# EAGLE design buckler (EAGLE 9.1.1)
AUTHOR: Branden Ghena; REV: A; TITLE: Berkeley Buckler

## Sheet 1 of 3: Headers
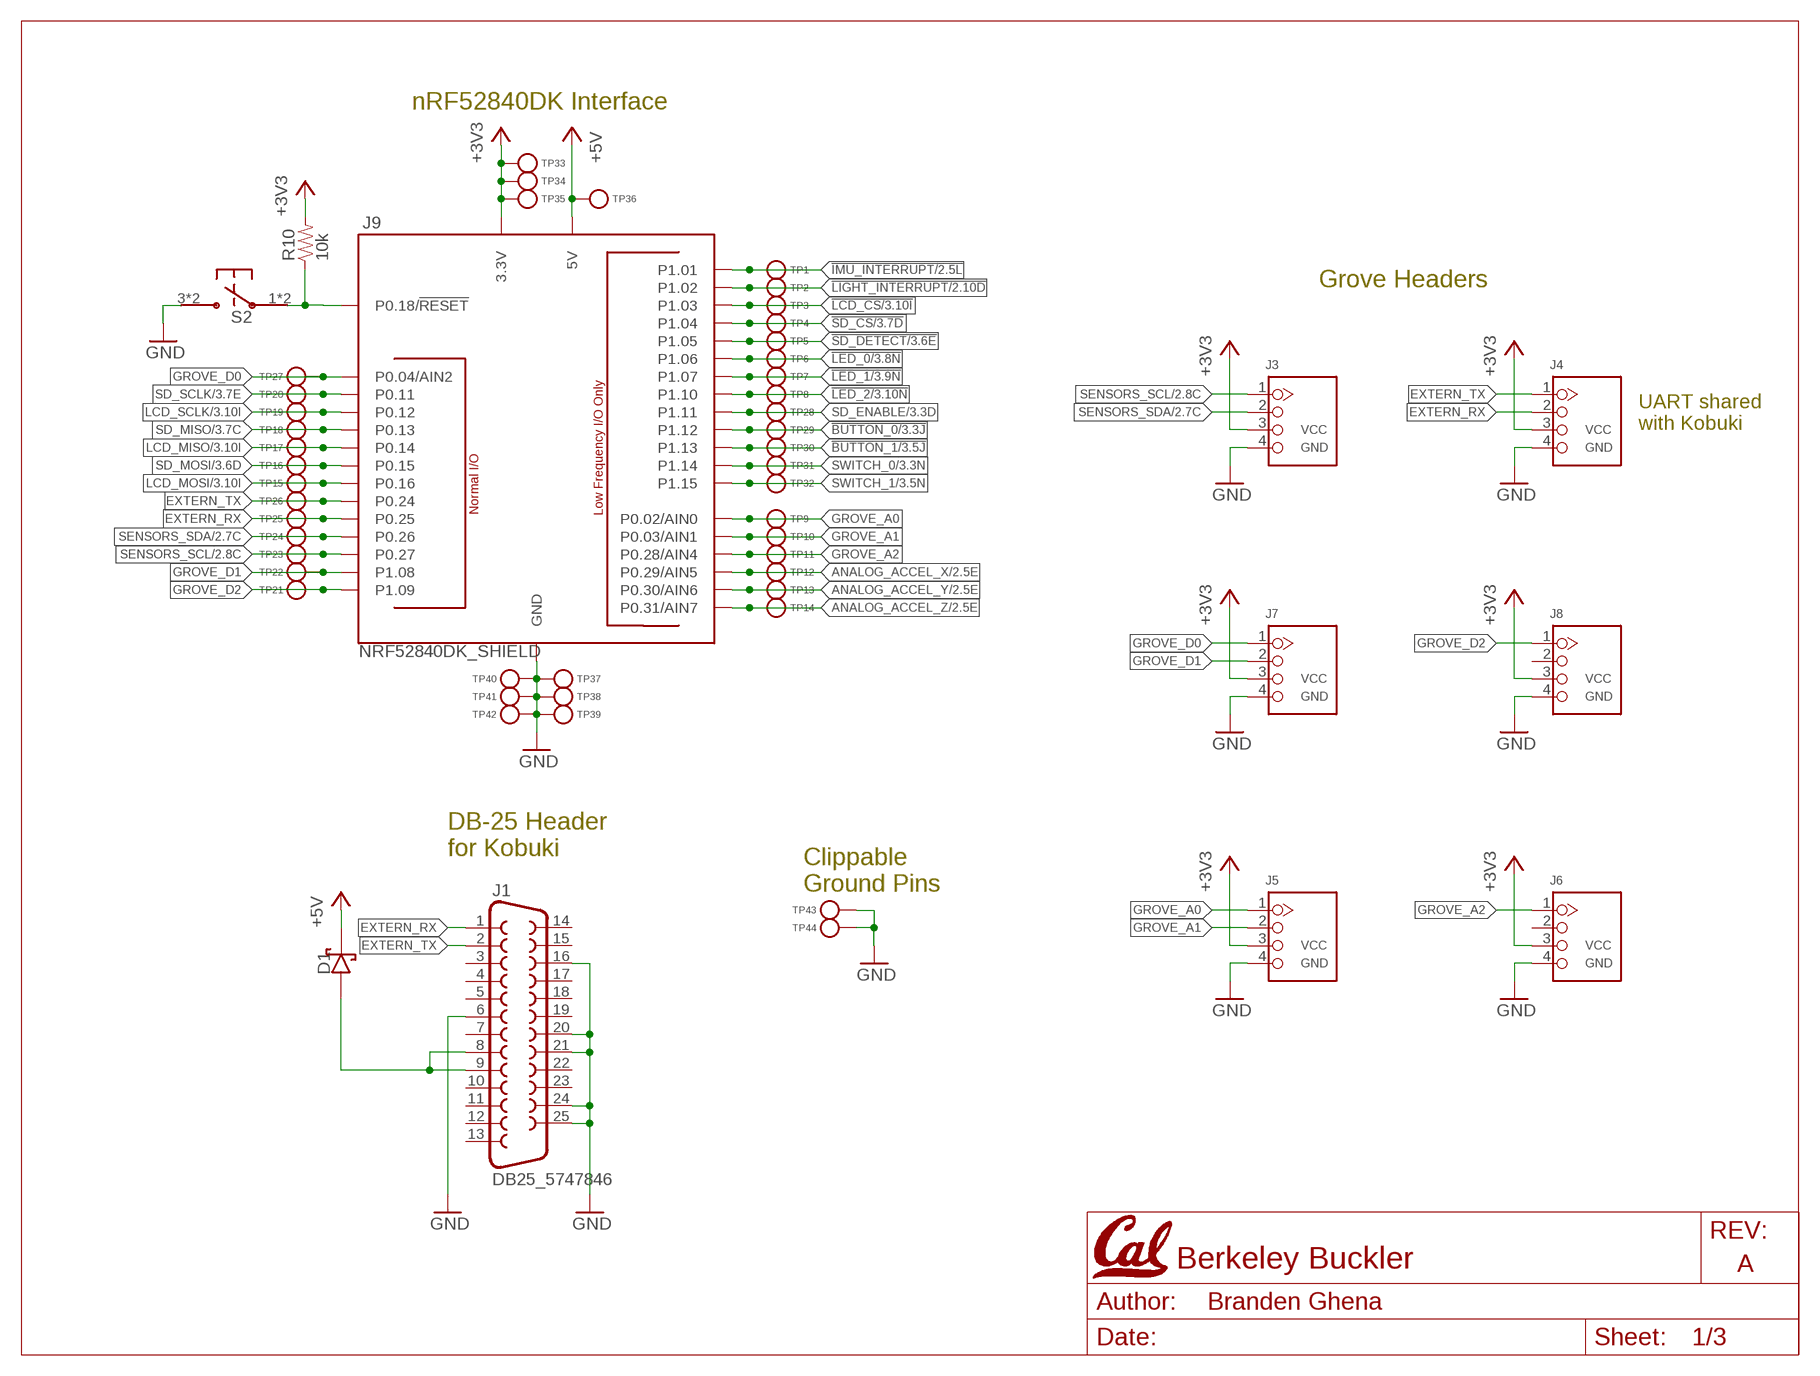
[diagram p0: schematic, sheet 1]
U$1 (LETTER_L_CAL): HEIGHT: 8.5in; WIDTH: 11in

### Parts
D1  DIODE_SCHOTTKYSOD323  [SOD323]
J1  DB25_5747846  [DB25_5747846]
J3  4P-2.0  GROVE-CONNECTOR-DIP(4P-2.0)  [HW4-2.0]
J4  4P-2.0  GROVE-CONNECTOR-DIP(4P-2.0)  [HW4-2.0]
J5  4P-2.0  GROVE-CONNECTOR-DIP(4P-2.0)  [HW4-2.0]
J6  4P-2.0  GROVE-CONNECTOR-DIP(4P-2.0)  [HW4-2.0]
J7  4P-2.0  GROVE-CONNECTOR-DIP(4P-2.0)  [HW4-2.0]
J8  4P-2.0  GROVE-CONNECTOR-DIP(4P-2.0)  [HW4-2.0]
J9  NRF52840DK_SHIELD  [NRF52840DK_SHIELD]
R10  10k  RESISTOR0402_RES  [0402_RES]
S2  PTS645SM43SMTR92  [PTS645]
TP1  TEST_POINT_0.040IN  [TESTPOINT_0.040IN]
TP2  TEST_POINT_0.040IN  [TESTPOINT_0.040IN]
TP3  TEST_POINT_0.040IN  [TESTPOINT_0.040IN]
TP4  TEST_POINT_0.040IN  [TESTPOINT_0.040IN]
TP5  TEST_POINT_0.040IN  [TESTPOINT_0.040IN]
TP6  TEST_POINT_0.040IN  [TESTPOINT_0.040IN]
TP7  TEST_POINT_0.040IN  [TESTPOINT_0.040IN]
TP8  TEST_POINT_0.040IN  [TESTPOINT_0.040IN]
TP9  TEST_POINT_0.040IN  [TESTPOINT_0.040IN]
TP10  TEST_POINT_0.040IN  [TESTPOINT_0.040IN]
TP11  TEST_POINT_0.040IN  [TESTPOINT_0.040IN]
TP12  TEST_POINT_0.040IN  [TESTPOINT_0.040IN]
TP13  TEST_POINT_0.040IN  [TESTPOINT_0.040IN]
TP14  TEST_POINT_0.040IN  [TESTPOINT_0.040IN]
TP15  TEST_POINT_0.040IN  [TESTPOINT_0.040IN]
TP16  TEST_POINT_0.040IN  [TESTPOINT_0.040IN]
TP17  TEST_POINT_0.040IN  [TESTPOINT_0.040IN]
TP18  TEST_POINT_0.040IN  [TESTPOINT_0.040IN]
TP19  TEST_POINT_0.040IN  [TESTPOINT_0.040IN]
TP20  TEST_POINT_0.040IN  [TESTPOINT_0.040IN]
TP21  TEST_POINT_0.040IN  [TESTPOINT_0.040IN]
TP22  TEST_POINT_0.040IN  [TESTPOINT_0.040IN]
TP23  TEST_POINT_0.040IN  [TESTPOINT_0.040IN]
TP24  TEST_POINT_0.040IN  [TESTPOINT_0.040IN]
TP25  TEST_POINT_0.040IN  [TESTPOINT_0.040IN]
TP26  TEST_POINT_0.040IN  [TESTPOINT_0.040IN]
TP27  TEST_POINT_0.040IN  [TESTPOINT_0.040IN]
TP28  TEST_POINT_0.040IN  [TESTPOINT_0.040IN]
TP29  TEST_POINT_0.040IN  [TESTPOINT_0.040IN]
TP30  TEST_POINT_0.040IN  [TESTPOINT_0.040IN]
TP31  TEST_POINT_0.040IN  [TESTPOINT_0.040IN]
TP32  TEST_POINT_0.040IN  [TESTPOINT_0.040IN]
TP33  TEST_POINT_0.040IN  [TESTPOINT_0.040IN]
TP34  TEST_POINT_0.040IN  [TESTPOINT_0.040IN]
TP35  TEST_POINT_0.040IN  [TESTPOINT_0.040IN]
TP36  TEST_POINT_0.040IN  [TESTPOINT_0.040IN]
TP37  TEST_POINT_0.040IN  [TESTPOINT_0.040IN]
TP38  TEST_POINT_0.040IN  [TESTPOINT_0.040IN]
TP39  TEST_POINT_0.040IN  [TESTPOINT_0.040IN]
TP40  TEST_POINT_0.040IN  [TESTPOINT_0.040IN]
TP41  TEST_POINT_0.040IN  [TESTPOINT_0.040IN]
TP42  TEST_POINT_0.040IN  [TESTPOINT_0.040IN]
TP43  TEST_POINT_0.078IN  [TESTPOINT_0.078IN]
TP44  TEST_POINT_0.078IN  [TESTPOINT_0.078IN]

### Nets
!BUTTON_0: J9.P1.12 TP29.TESTPOINT ; also sheet 3
!BUTTON_1: J9.P1.13 TP30.TESTPOINT ; also sheet 3
!IMU_INTERRUPT: J9.P1.01 TP1.TESTPOINT ; also sheet 2
!LCD_CS: J9.P1.03 TP3.TESTPOINT ; also sheet 3
!LED_0: J9.P1.06 TP6.TESTPOINT ; also sheet 3
!LED_1: J9.P1.07 TP7.TESTPOINT ; also sheet 3
!LED_2: J9.P1.10 TP8.TESTPOINT ; also sheet 3
!LIGHT_INTERRUPT: J9.P1.02 TP2.TESTPOINT ; also sheet 2
!SD_CS: J9.P1.04 TP4.TESTPOINT ; also sheet 3
!SD_DETECT: J9.P1.05 TP5.TESTPOINT ; also sheet 3
+3V3: J3.3 J4.3 J5.3 J6.3 J7.3 J8.3 J9.3.3V@0(3.3V) J9.3.3V@1(3.3V) J9.3.3V@2(3.3V) R10.2 TP33.TESTPOINT TP34.TESTPOINT TP35.TESTPOINT ; also sheet 2,3
+5V: D1.P$1(CATHODE) J9.5V TP36.TESTPOINT
ANALOG_ACCEL_X: J9.P0.29(P0.29/AIN5) TP12.TESTPOINT ; also sheet 2
ANALOG_ACCEL_Y: J9.P0.30(P0.30/AIN6) TP13.TESTPOINT ; also sheet 2
ANALOG_ACCEL_Z: J9.P0.31(P0.31/AIN7) TP14.TESTPOINT ; also sheet 2
EXTERN_RX: J1.1 J4.2 J9.P0.25 TP25.TESTPOINT
EXTERN_TX: J1.2 J4.1 J9.P0.24 TP26.TESTPOINT
GND: J1.6 J1.16 J1.20 J1.21 J1.24 J1.25 J3.4 J4.4 J5.4 J6.4 J7.4 J8.4 J9.GND@0(GND) J9.GND@1(GND) J9.GND@2(GND) J9.GND@3(GND) S2.3 S2.4 TP37.TESTPOINT TP38.TESTPOINT TP39.TESTPOINT TP40.TESTPOINT TP41.TESTPOINT TP42.TESTPOINT TP43.1(TESTPOINT) TP44.1(TESTPOINT) ; also sheet 2,3
GROVE_A0: J5.1 J9.P0.02(P0.02/AIN0) TP9.TESTPOINT
GROVE_A1: J5.2 J9.P0.03(P0.03/AIN1) TP10.TESTPOINT
GROVE_A2: J6.1 J9.P0.28(P0.28/AIN4) TP11.TESTPOINT
GROVE_D0: J7.1 J9.P0.04(P0.04/AIN2) TP27.TESTPOINT
GROVE_D1: J7.2 J9.P1.08 TP22.TESTPOINT
GROVE_D2: J8.1 J9.P1.09 TP21.TESTPOINT
LCD_MISO: J9.P0.14 TP17.TESTPOINT ; also sheet 3
LCD_MOSI: J9.P0.16 TP15.TESTPOINT ; also sheet 3
LCD_SCLK: J9.P0.12 TP19.TESTPOINT ; also sheet 3
N$1: J9.P0.18(P0.18/!RESET) R10.1 S2.1 S2.2
N$2: D1.P$2(ANODE) J1.8 J1.9
SD_ENABLE: J9.P1.11 TP28.TESTPOINT ; also sheet 3
SD_MISO: J9.P0.13 TP18.TESTPOINT ; also sheet 3
SD_MOSI: J9.P0.15 TP16.TESTPOINT ; also sheet 3
SD_SCLK: J9.P0.11 TP20.TESTPOINT ; also sheet 3
SENSORS_SCL: J3.1 J9.P0.27 TP23.TESTPOINT ; also sheet 2
SENSORS_SDA: J3.2 J9.P0.26 TP24.TESTPOINT ; also sheet 2
SWITCH_0: J9.P1.14 TP31.TESTPOINT ; also sheet 3
SWITCH_1: J9.P1.15 TP32.TESTPOINT ; also sheet 3
Unconnected: J1.3 J1.4 J1.5 J1.7 J1.10 J1.11 J1.12 J1.13 J1.14 J1.15 J1.17 J1.18 J1.19 J1.22 J1.23 J6.2 J8.2

### Notes on the sheet
- nRF52840DK Interface
- Grove Headers
- UART shared
  with Kobuki
- DB-25 Header
  for Kobuki
- Clippable
  Ground Pins

## Sheet 2 of 3: Sensors
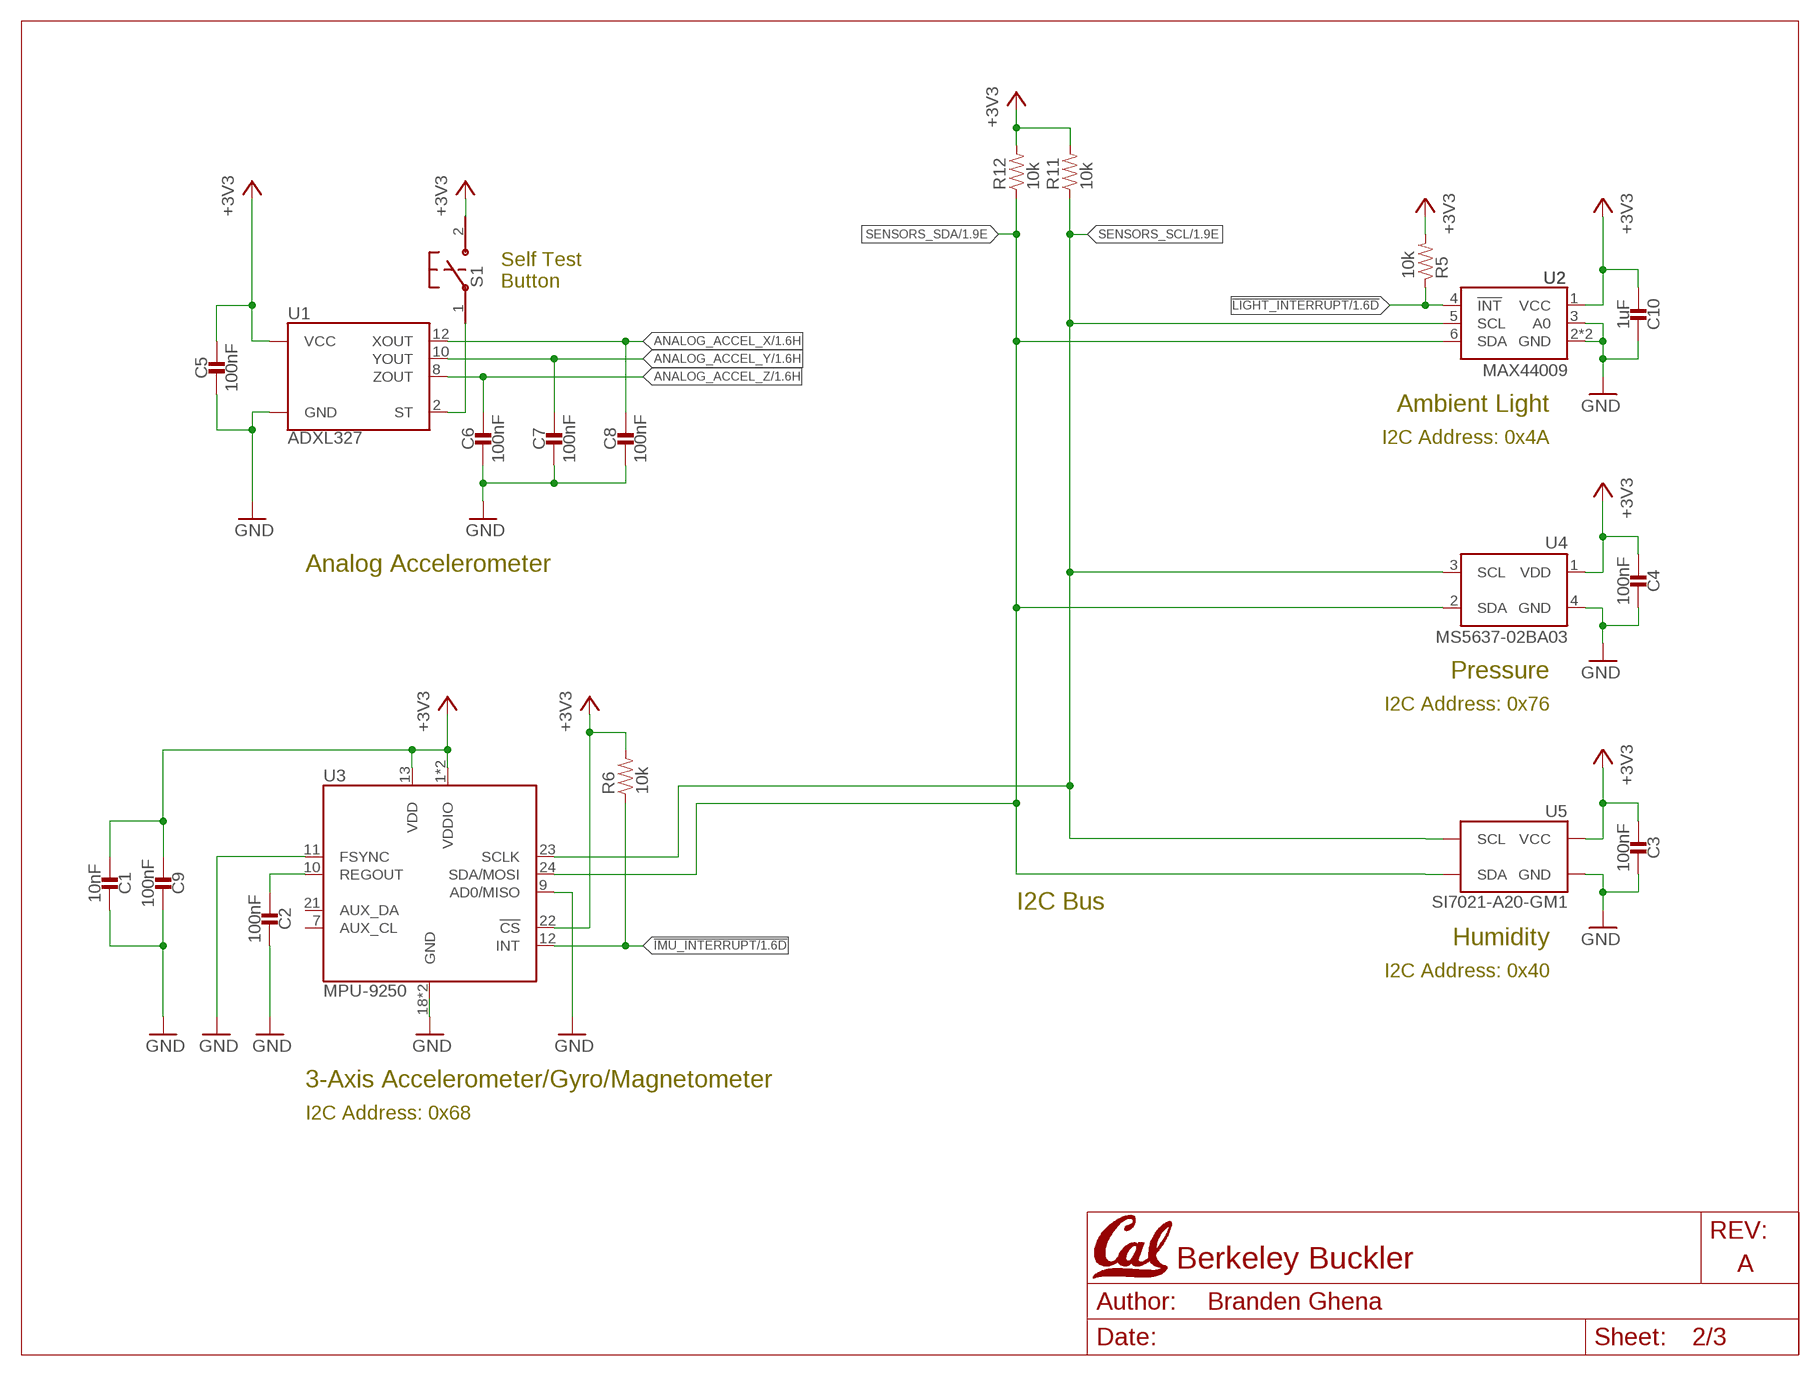
[diagram p1: schematic, sheet 2]
U$2 (LETTER_L_CAL): HEIGHT: 8.5in; WIDTH: 11in

### Parts
C1  10nF  CAPACITOR0402_CAP  [0402_CAP]
C2  100nF  CAPACITOR0402_CAP  [0402_CAP]
C3  100nF  CAPACITOR0402_CAP  [0402_CAP]
C4  100nF  CAPACITOR0402_CAP  [0402_CAP]
C5  100nF  CAPACITOR0402_CAP  [0402_CAP]
C6  100nF  CAPACITOR0402_CAP  [0402_CAP]
C7  100nF  CAPACITOR0402_CAP  [0402_CAP]
C8  100nF  CAPACITOR0402_CAP  [0402_CAP]
C9  100nF  CAPACITOR0402_CAP  [0402_CAP]
C10  1uF  CAPACITOR0402_CAP  [0402_CAP]
R5  10k  RESISTOR0402_RES  [0402_RES]
R6  10k  RESISTOR0402_RES  [0402_RES]
R11  10k  RESISTOR0402_RES  [0402_RES]
R12  10k  RESISTOR0402_RES  [0402_RES]
S1  B3U-1000P  [B3U-1000P]
U1  ADXL327  [LFCSP-16]
U2  MAX44009  [UDFN-6-EXPOSED]
U3  MPU-9250  [QFN-24/3MM]
U4  MS5637-02BA03  [4-SMD]
U5  SI7021-A20-GM1  [DFN-6/3MM]

### Nets
!IMU_INTERRUPT: R6.1 U3.12(INT) ; also sheet 1
!LIGHT_INTERRUPT: R5.1 U2.4(!INT) ; also sheet 1
+3V3: C1.1 C3.1 C4.1 C5.1 C9.1 C10.1 R5.2 R6.2 R11.2 R12.2 S1.2 U1.14(VCC) U1.15(VCC) U2.1(VCC) U3.1(VDDIO) U3.8(VDDIO) U3.13(VDD) U3.22(!CS) U4.1(VDD) U5.5(VCC) ; also sheet 1,3
ANALOG_ACCEL_X: C8.1 U1.12(XOUT) ; also sheet 1
ANALOG_ACCEL_Y: C7.1 U1.10(YOUT) ; also sheet 1
ANALOG_ACCEL_Z: C6.1 U1.8(ZOUT) ; also sheet 1
GND: C1.2 C2.2 C3.2 C4.2 C5.2 C6.2 C7.2 C8.2 C9.2 C10.2 U1.3(GND) U1.5(GND) U1.6(GND) U1.7(GND) U2.2(GND) U2.3(A0) U2.EP(GND) U3.9(AD0/MISO) U3.11(FSYNC) U3.18(GND) U3.20(GND) U4.4(GND) U5.2(GND) ; also sheet 1,3
N$7: S1.1 U1.2(ST)
N$19: C2.1 U3.10(REGOUT)
SENSORS_SCL: R11.1 U2.5(SCL) U3.23(SCLK) U4.3(SCL) U5.6(SCL) ; also sheet 1
SENSORS_SDA: R12.1 U2.6(SDA) U3.24(SDA/MOSI) U4.2(SDA) U5.1(SDA) ; also sheet 1
Unconnected: U3.7(AUX_CL) U3.21(AUX_DA)

### Notes on the sheet
- Self Test
  Button
- Ambient Light
- I2C Address: 0x4A
- Analog Accelerometer
- Pressure
- I2C Address: 0x76
- I2C Bus
- Humidity
- I2C Address: 0x40
- 3-Axis Accelerometer/Gyro/Magnetometer
- I2C Address: 0x68

## Sheet 3 of 3: Other Peripherals
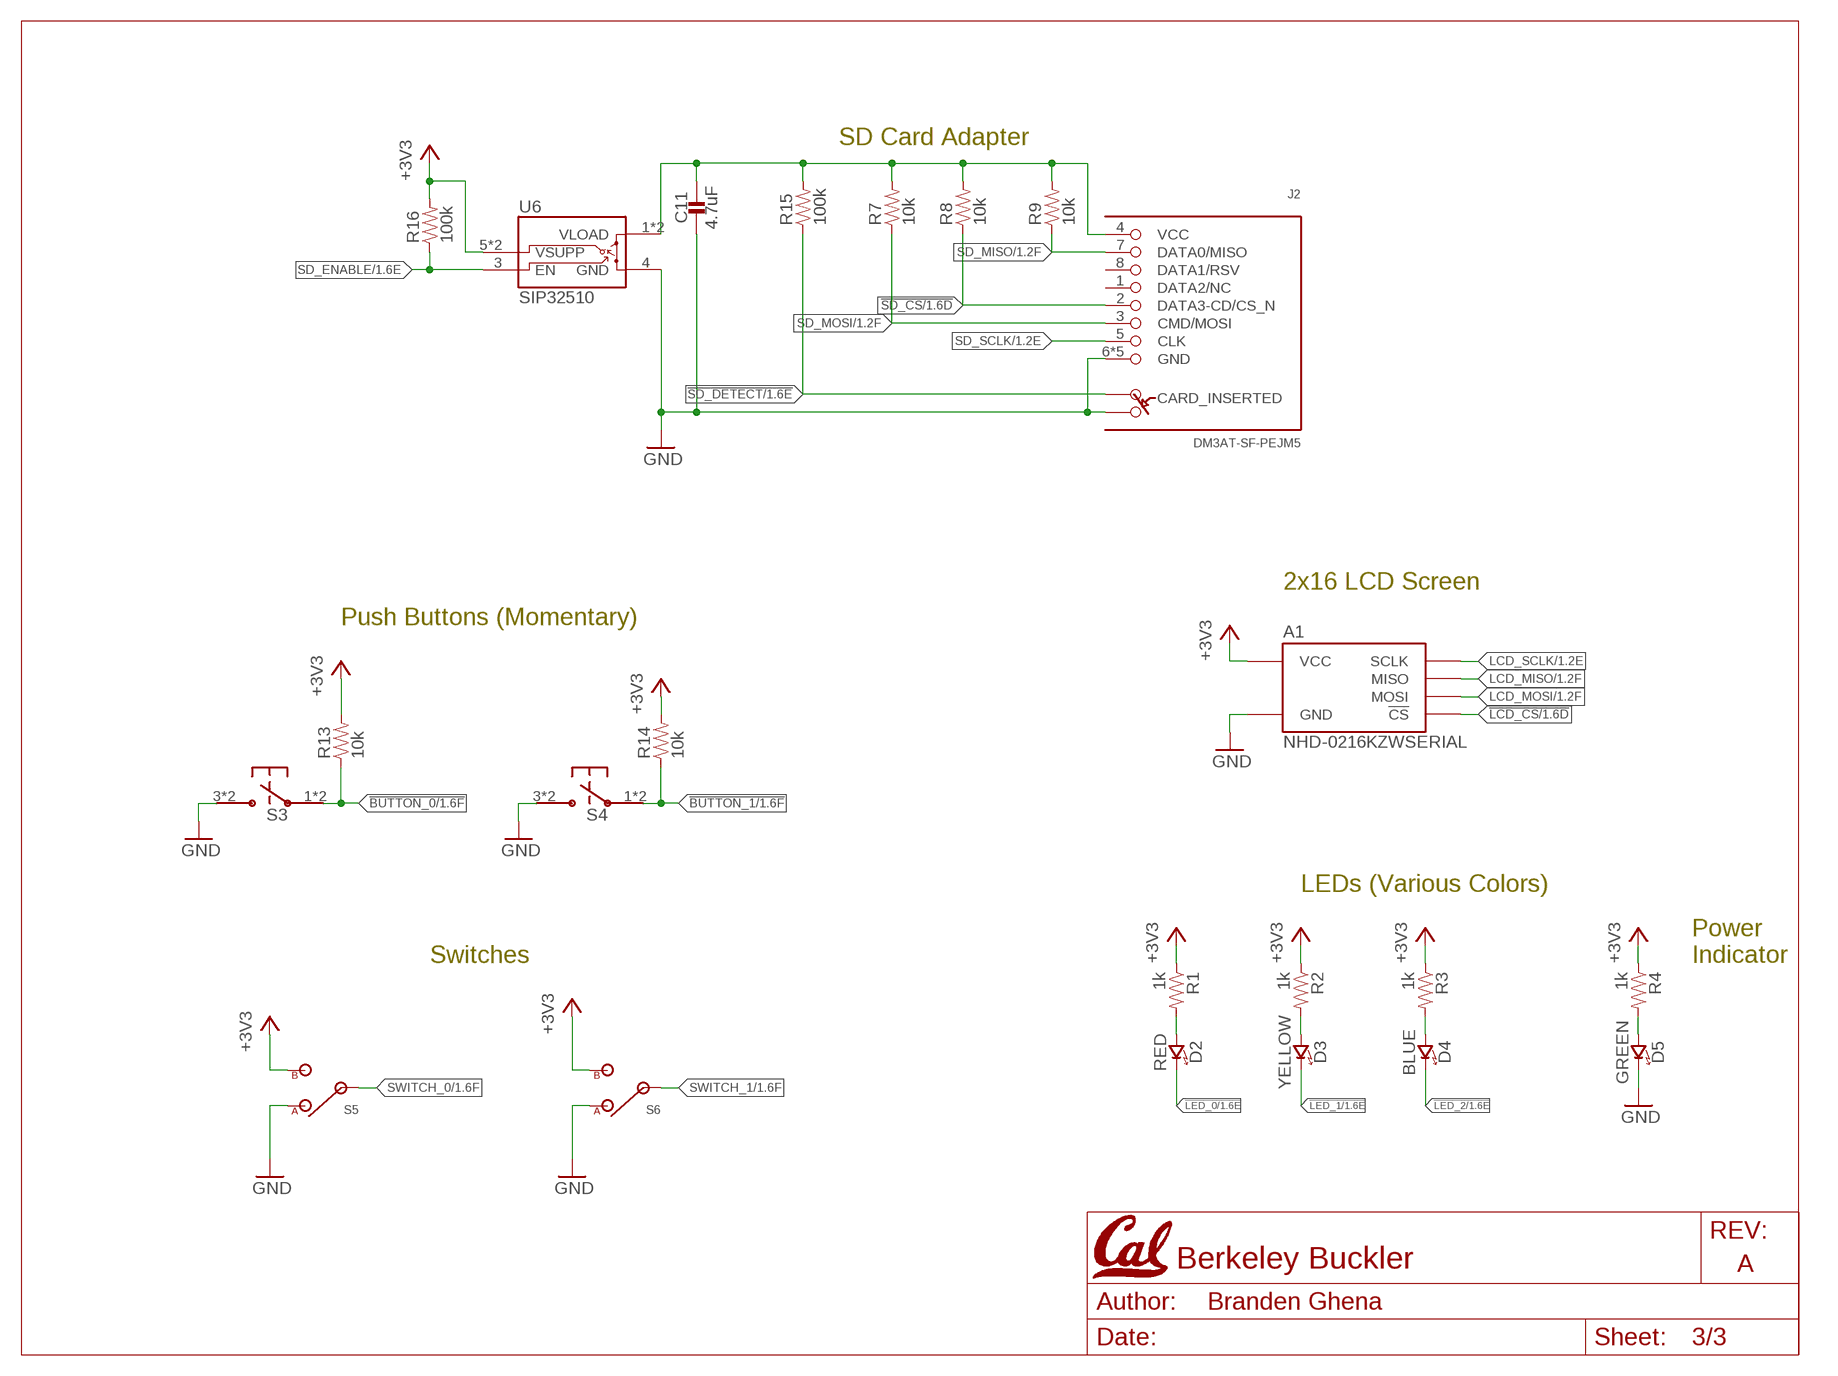
[diagram p2: schematic, sheet 3]
U$3 (LETTER_L_CAL): HEIGHT: 8.5in; WIDTH: 11in

### Parts
A1  NHD-0216KZWSERIAL  [NHD-0216KZW]
C11  4.7uF  CAPACITOR0402_CAP  [0402_CAP]
D2  RED  LED0603  [LED-0603]
D3  YELLOW  LED0603  [LED-0603]
D4  BLUE  LED0603  [LED-0603]
D5  GREEN  LED0603  [LED-0603]
J2  DM3AT-SF-PEJM5  [DM3AT-SF-PEJM5]
R1  1k  RESISTOR0402_RES  [0402_RES]
R2  1k  RESISTOR0402_RES  [0402_RES]
R3  1k  RESISTOR0402_RES  [0402_RES]
R4  1k  RESISTOR0402_RES  [0402_RES]
R7  10k  RESISTOR0402_RES  [0402_RES]
R8  10k  RESISTOR0402_RES  [0402_RES]
R9  10k  RESISTOR0402_RES  [0402_RES]
R13  10k  RESISTOR0402_RES  [0402_RES]
R14  10k  RESISTOR0402_RES  [0402_RES]
R15  100k  RESISTOR0402_RES  [0402_RES]
R16  100k  RESISTOR0402_RES  [0402_RES]
S3  PTS645SM43SMTR92  [PTS645]
S4  PTS645SM43SMTR92  [PTS645]
S5  TE_SSA12/SPDT  [TE_SSA12/SPDT]
S6  TE_SSA12/SPDT  [TE_SSA12/SPDT]
U6  SIP32510  [TSOT23-6]

### Nets
!BUTTON_0: R13.1 S3.1 S3.2 ; also sheet 1
!BUTTON_1: R14.1 S4.1 S4.2 ; also sheet 1
!LCD_CS: A1.16(!CS) ; also sheet 1
!LED_0: D2.C(CATHODE) ; also sheet 1
!LED_1: D3.C(CATHODE) ; also sheet 1
!LED_2: D4.C(CATHODE) ; also sheet 1
!SD_CS: J2.2(DATA3-CD/CS_N) R8.1 ; also sheet 1
!SD_DETECT: J2.A R15.1 ; also sheet 1
+3V3: A1.2(VCC) R1.1 R2.1 R3.1 R4.1 R13.2 R14.2 R16.2 S5.2(B) S6.2(B) U6.5(VSUPP) U6.6(VSUPP) ; also sheet 1,2
GND: A1.1(GND) C11.2 D5.C(CATHODE) J2.6(GND) J2.B J2.MOUNT0(GND) J2.MOUNT1(GND) J2.MOUNT2(GND) J2.MOUNT3(GND) S3.3 S3.4 S4.3 S4.4 S5.1(A) S6.1(A) U6.4(GND) ; also sheet 1,2
LCD_MISO: A1.13(MISO) ; also sheet 1
LCD_MOSI: A1.14(MOSI) ; also sheet 1
LCD_SCLK: A1.12(SCLK) ; also sheet 1
N$3: D5.A(ANODE) R4.2
N$4: D4.A(ANODE) R3.2
N$5: D3.A(ANODE) R2.2
N$18: C11.1 J2.4(VCC) R7.2 R8.2 R9.2 R15.2 U6.1(VLOAD) U6.2(VLOAD)
N$25: D2.A(ANODE) R1.2
SD_ENABLE: R16.1 U6.3(EN) ; also sheet 1
SD_MISO: J2.7(DATA0/MISO) R9.1 ; also sheet 1
SD_MOSI: J2.3(CMD/MOSI) R7.1 ; also sheet 1
SD_SCLK: J2.5(CLK) ; also sheet 1
SWITCH_0: S5.IN ; also sheet 1
SWITCH_1: S6.IN ; also sheet 1
Unconnected: J2.1(DATA2/NC) J2.8(DATA1/RSV)

### Notes on the sheet
- SD Card Adapter
- 2x16 LCD Screen
- Push Buttons (Momentary)
- LEDs (Various Colors)
- Switches
- Power
  Indicator

## Library data of the parts
A1 = headers:NHD-0216KZW; DIGIKEY: NHD-0216KZW-AG5-ND,952-3305-ND; DIGIKEY1: NHD-0216KZW-AG5-ND; DIGIKEY2: 952-3305-ND
C1 = passives:CAPACITOR: SMD Capacitor; DESCRIPTION: CAP CER 10000PF 25V X7R 0402; DIGIKEY: 399-1279-1-ND; MANUFACTURER: KEMET; MPN: C0402C103J3RACTU
C2-C9 = passives:CAPACITOR: SMD Capacitor; DESCRIPTION: CAP CER 0.1UF 16V X7R 0402; DIGIKEY: 490-4759-1-ND; MANUFACTURER: Murata; MPN: GCM155R71C104KA55D
C10 = passives:CAPACITOR: SMD Capacitor; DESCRIPTION: CAP CER 1UF 10V X6S 0402; DIGIKEY: 1276-6805-1-ND; MANUFACTURER: Samsung Electro-Mechanics; MPN: CL05X105KP5NNNC
C11 = passives:CAPACITOR: SMD Capacitor; DESCRIPTION: CAP CER 4.7UF 10V X5R 0402; DIGIKEY: 1276-1480-1-ND; MANUFACTURER: Samsung Electro-Mechanics; MPN: CL05A475KP5NRNC
D1 = passives:DIODE_SCHOTTKY; DESCRIPTION: DIODE SCHOTTKY 30V 500MA SOD323; DIGIKEY: B0530WS-FDICT-ND; MANUFACTURER: Diodes Incorporated; MPN: B0530WS-7-F
D2 = leds:LED: LED; DESCRIPTION: LED RED CLEAR CHIP SMD; DIGIKEY: 160-1436-1-ND; MANUFACTURER: Lite-On Inc.; MPN: LTST-C190KRKT
D3 = leds:LED: LED; DESCRIPTION: LED YELLOW CLEAR CHIP SMD; DIGIKEY: 160-1437-1-ND; MANUFACTURER: Lite-On Inc.; MPN: LTST-C190KSKT
D4 = leds:LED: LED; DESCRIPTION: LED BLUE CLEAR SMD; DIGIKEY: 160-1837-1-ND; MANUFACTURER: Lite-On Inc.; MPN: LTST-C194TBKT
D5 = leds:LED: LED; DESCRIPTION: LED GREEN CLEAR CHIP SMD; DIGIKEY: 160-1435-1-ND; MANUFACTURER: Lite-On Inc.; MPN: LTST-C190KGKT
J1 = headers:DB25_5747846; DESCRIPTION: CONN D-SUB RCPT 25POS R/A SOLDER; DIGIKEY: A32126-ND; MANUFACTURER: TE Connectivity AMP Connectors; MPN: 5747846-4
J2 = connector:DM3AT-SF-PEJM5: CONN MICRO SD R/A PUSH-PUSH SMD; DESCRIPTION: CONN MICRO SD CARD PUSH-PUSH R/A; DIGIKEY: HR1964CT-ND; MANUFACTURER: Hirose Electric Co Ltd; MPN: DM3AT-SF-PEJM5
J3-J8 = headers:GROVE-CONNECTOR-DIP(4P-2.0): 320110033; DESCRIPTION: Grove - Universal 4 pin connector; MANUFACTURER: Seeed Studio; MOUSER: 713-110990030; MPN: 110990030
J9 = headers:NRF52840DK_SHIELD: Shield for the PCA10056 nRF52840 Development Kit; DESCRIPTION: Headers for nRF52840DK. There are 6 separate headers to be installed through the board.; DIGIKEY1: S1011EC-10-ND; DIGIKEY2: S1011EC-08-ND; DIGIKEY3: S1011EC-08-ND; DIGIKEY4: S1011EC-08-ND; DIGIKEY5: S1011EC-06-ND; DIGIKEY6: S2011EC-09-ND
R1-R4 = passives:RESISTOR: Resistor Basic schematic elements and footprints for 0201, 0402, 0603, 1206, and PTH resistors.; DESCRIPTION: RES SMD 1K OHM 1% 1/16W 0402; DIGIKEY: RMCF0402FT1K00CT-ND; MANUFACTURER: Stackpole Electronics; MPN: RMCF0402FT1K00
R5-R14 = passives:RESISTOR: Resistor Basic schematic elements and footprints for 0201, 0402, 0603, 1206, and PTH resistors.; DESCRIPTION: RES SMD 10K OHM 1% 1/16W 0402; DIGIKEY: 1276-3431-1-ND; MANUFACTURER: Samsung Electro-Mechanics; MPN: RC1005F103CS
R15 R16 = passives:RESISTOR: Resistor Basic schematic elements and footprints for 0201, 0402, 0603, 1206, and PTH resistors.; DESCRIPTION: RES SMD 100K OHM 1% 1/5W 0402; DIGIKEY: 541-100KYCT-ND; MANUFACTURER: Vishay Dale; MPN: CRCW0402100KFKEDHP
S1 = switches:B3U: Switch; DESCRIPTION: SWITCH TACTILE SPST-NO 0.05A 12V; DIGIKEY: SW1020CT-ND; MANUFACTURER: Omron; MPN: B3U-1000P
S2-S4 = switches:PTS645SM43SMTR92: Tactile Switch SPST-NO Top Actuated Surface Mount; DESCRIPTION: SWITCH TACTILE SPST-NO 0.05A 12V; DIGIKEY: CKN9112CT-ND; MANUFACTURER: C&K; MPN: PTS645SM43SMTR92 LFS
S5 S6 = switches:TE_SSA12/SPDT: SWITCH SLIDE SPDT 2POS SSA SER; DESCRIPTION: SWITCH SLIDE SPDT 100MA 30V; DIGIKEY: 450-1602-ND; MANUFACTURER: TE Connectivity ALCOSWITCH Switches; MPN: SSA12
TP1-TP42 = headers:TEST_POINT_0.040IN: 0.040in Test Point; DIGIKEY: 5001K-ND
TP43 TP44 = headers:TEST_POINT_0.078IN; DESCRIPTION: TERM TURRET SINGLE L=4.75MM TIN; DIGIKEY: 36-1520-2-ND; MANUFACTURER: Keystone Electronics; MPN: 1520-2
U1 = chips:ADXL327: ADXL327 3-Axis Analog Accelerometer; DESCRIPTION: ACCELEROMETER 2G ANALOG 16LFCSP; DIGIKEY: ADXL327BCPZ-ND; MANUFACTURER: Analog Devices Inc.; MPN: ADXL327BCPZ
U2 = chips:MAX44009: low power ambient light sensor; DESCRIPTION: SENSOR AMBIENT LIGHT 6UTDFN; DIGIKEY: MAX44009EDT+TCT-ND; MANUFACTURER: Maxim Integrated; MPN: MAX44009EDT+T
U3 = chips:MPU-9250: GYRO/ACCEL/COMPASS/9-AXIS; DESCRIPTION: IMU ACCEL/GYRO/MAG I2C/SPI 24QFN; DIGIKEY: 1428-1019-1-ND; MANUFACTURER: TDK InvenSense; MPN: MPU-9250
U4 = chips:MS5637-02BA03: low power pressure sensor; DESCRIPTION: SENSOR 17.4PSIA I2C 24B 4-QFN; DIGIKEY: 223-1199-1-ND; MANUFACTURER: TE CONNECTIVITY; MPN: MS563702BA03-50
U5 = chips:SI7021: IC TEMP SENSOR RH 2% DFN; DESCRIPTION: SENS HUMI/TEMP 3.6V I2C 3% 6DFN; DIGIKEY: 336-3141-ND; MANUFACTURER: Silicon Labs; MOUSER: 634-SI7021-A20-GM1; MPN: SI7021-A20-GM1
U6 = chips:SIP32510: Load switch, slew rate controlled. By Vishay; DESCRIPTION: IC LOAD SWITCH SOT23-6; DIGIKEY: SIP32510DT-T1-GE3CT-ND; MANUFACTURER: Vishay; MPN: SIP32510DT-T1-GE3

## Board
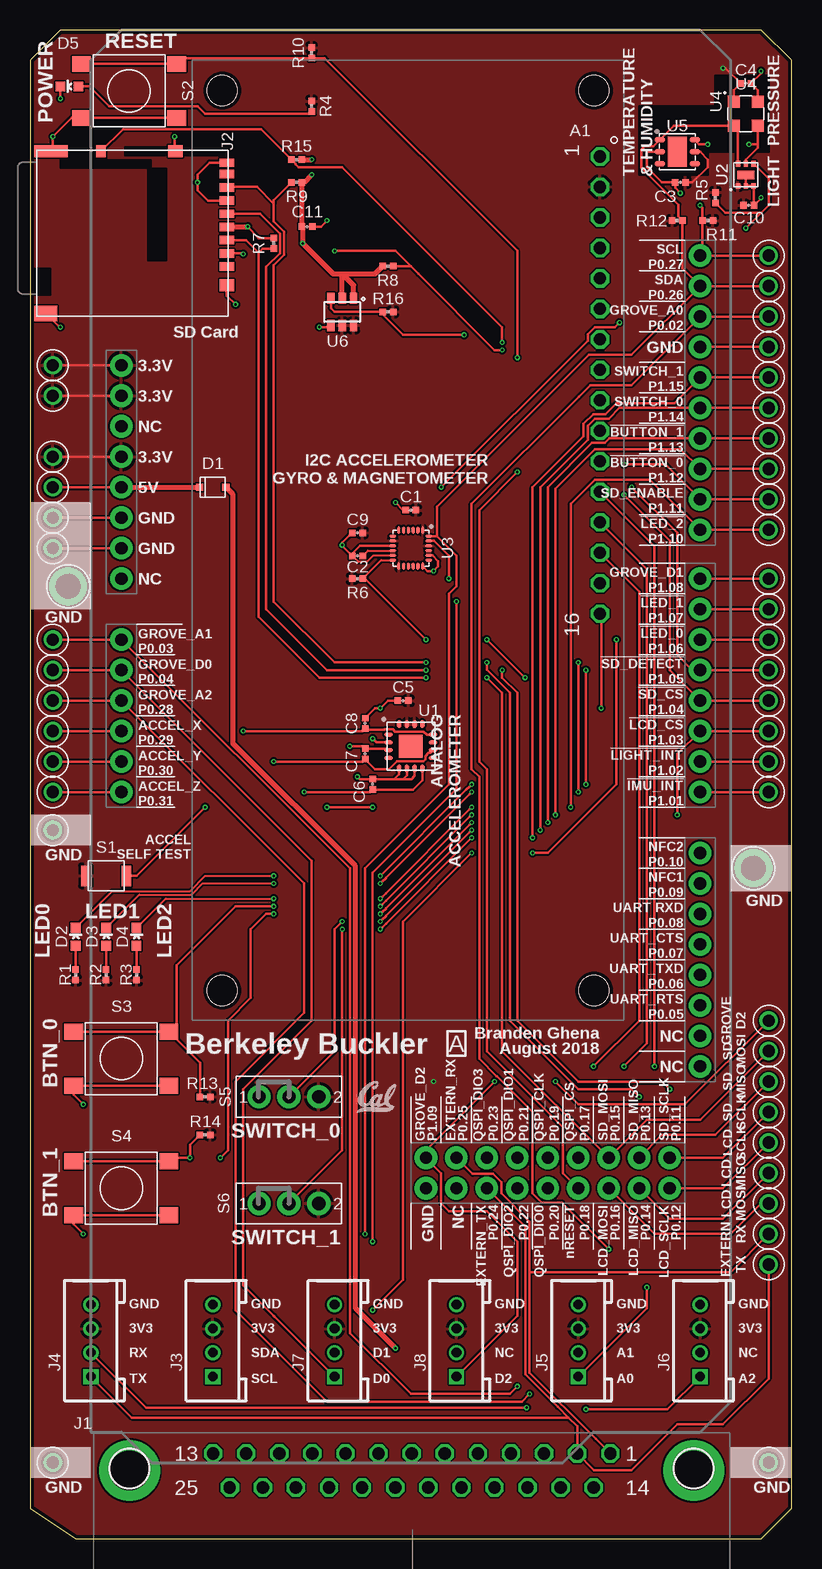
[diagram p3: board, top side]
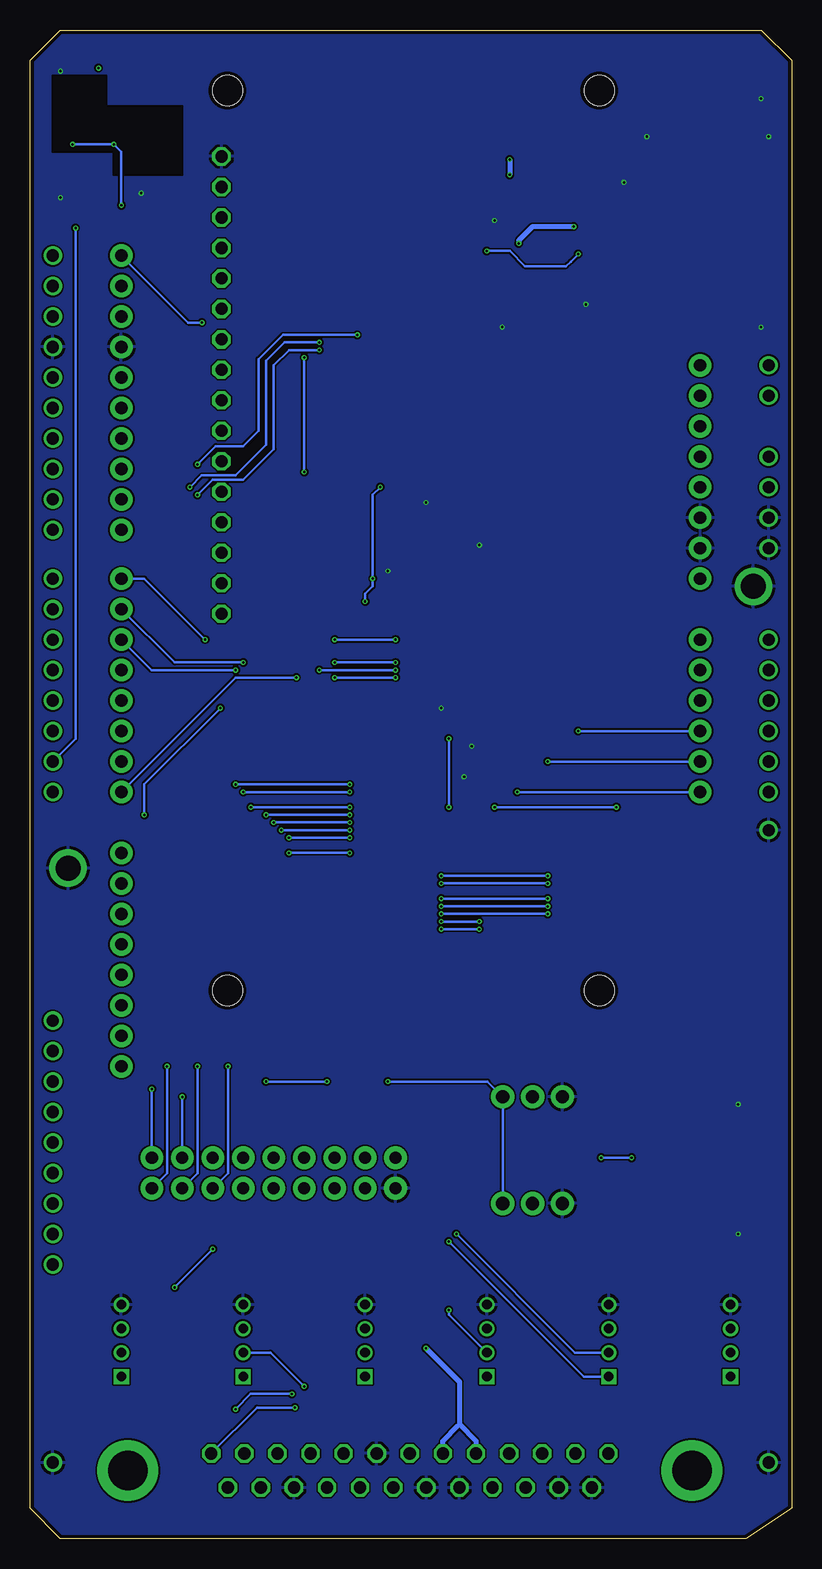
[diagram p4: board, bottom side, seen from below]

Size 63.5 x 125.73 mm. Coordinates in mm from the lower left corner, seen from the top.
Outline: 60.96,125.73 2.54,125.73 0,123.19 0,2.54 3.81,0 8.89,0 43.18,0 46.99,0 55.88,0 58.42,0 60.96,0 63.5,2.54 63.5,123.19 60.96,125.73
Copper layers (1*16): Top 0.0178mm / dielectric 59mil / Bottom 0.0178mm
Design rules "quickturn_co_kr_1oz *": minimum track width 6mil, minimum drill 0.200659375mm, track to track 6mil, track to pad 6mil, pad to pad 6mil, via to via 6mil, smd to smd 6mil, copper to edge 12mil, drill to drill 12mil, minimum pad ring 8mil, minimum via ring 4mil, stop-mask expansion 3mil, vias tented up to drill 50mil, thermal gap 10mil

### Footprints (pad centres in the part's own frame; a part is rotated, then mirrored left to right if it is on the bottom)
NHD-0216KZW = drill 1.016 octagon: 1 8,-2; 2 10.54,-2; 3 13.08,-2; 4 15.62,-2; 5 18.16,-2; 6 20.7,-2; 7 23.24,-2; 8 25.78,-2; 9 28.32,-2; 10 30.86,-2; 11 33.4,-2; 12 35.94,-2; 13 38.48,-2; 14 41.02,-2; 15 43.56,-2; 16 46.1,-2 | hole 2.5: 2.5,-2.5; 2.5,-33.5; 77.5,-33.5; 77.5,-2.5
0402_CAP = smd 0.536 x 0.546: 1 -0.433,0; 2 0.433,0
SOD323 = smd 0.6 x 0.6: P$1 -1.1,0; P$2 1.1,0
LED-0603 = smd 0.8 x 0.8: A 0,-0.75; C 0,0.75
DB25_5747846 = drill 1.016 octagon: 1 0,0; 2 2.76,0; 3 5.52,0; 4 8.28,0; 5 11.041,0; 6 13.801,0; 7 16.561,0; 8 19.321,0; 9 22.081,0; 10 24.841,0; 11 27.601,0; 12 30.362,0; 13 33.122,0; 14 1.379,2.845; 15 4.139,2.845; 16 6.898,2.845; 17 9.657,2.845; 18 12.417,2.845; 19 15.176,2.845; 20 17.935,2.845; 21 20.695,2.845; 22 23.454,2.845; 23 26.213,2.845; 24 28.973,2.845; 25 31.732,2.845 | drill 3.302 pad 5.08: G1 -6.96,1.422; G2 40.081,1.422
DM3AT-SF-PEJM5 = smd 0.7 x 1.2: 1 3.2,-0.1; 2 2.1,-0.1; 3 1,-0.1; 4 -0.1,-0.1; 5 -1.2,-0.1; 6 -2.3,-0.1; 7 -3.4,-0.1; 8 -4.5,-0.1; B -5.45,-0.1 | smd 1 x 0.8: A -6.4,-10.6 | smd 1 x 1.2: MOUNT0 4.75,-0.1; MOUNT1 -6.4,-4.4 | smd 1 x 2.8: MOUNT2 -6.4,-14.75 | smd 1.3 x 1.9: MOUNT3 7.1,-15.2
HW4-2.0 = drill 0.8 pad 1.27 square: 1 -3,0 | drill 0.8 pad 1.27: 2 -1,0; 3 1,0; 4 3,0
NRF52840DK_SHIELD = drill 1.016 pad 1.88: 3.3V@0 0,-7.62; 3.3V@1 0,-2.54; 3.3V@2 0,0; 5V 0,-10.16; !RESET 0,-5.08; GND@0 0,-12.7; GND@1 0,-15.24; GND@2 48.26,1.524; GND@3 25.4,-68.58; NC@0 0,-17.78; NC@1 48.26,-55.88; NC@2 48.26,-58.42; NC@4 27.94,-68.58; P0.02 48.26,4.064; P0.03 0,-22.86; P0.04 0,-25.4; P0.05 48.26,-53.34; P0.06 48.26,-50.8; P0.07 48.26,-48.26; P0.08 48.26,-45.72; P0.09 48.26,-43.18; P0.10 48.26,-40.64; P0.11 45.72,-66.04; P0.12 45.72,-68.58; P0.13 43.18,-66.04; P0.14 43.18,-68.58; P0.15 40.64,-66.04; P0.16 40.64,-68.58; P0.17 38.1,-66.04; P0.18 38.1,-68.58; P0.19 35.56,-66.04; P0.20 35.56,-68.58; P0.21 33.02,-66.04; P0.22 33.02,-68.58; P0.23 30.48,-66.04; P0.24 30.48,-68.58; P0.25 27.94,-66.04; P0.26 48.26,6.604; P0.27 48.26,9.144; P0.28 0,-27.94; P0.29 0,-30.48; P0.30 0,-33.02; P0.31 0,-35.56; P1.01 48.26,-35.56; P1.02 48.26,-33.02; P1.03 48.26,-30.48; P1.04 48.26,-27.94; P1.05 48.26,-25.4; P1.06 48.26,-22.86; P1.07 48.26,-20.32; P1.08 48.26,-17.78; P1.09 25.4,-66.04; P1.10 48.26,-13.716; P1.11 48.26,-11.176; P1.12 48.26,-8.636; P1.13 48.26,-6.096; P1.14 48.26,-3.556; P1.15 48.26,-1.016
0402_RES = smd 0.536 x 0.546: 1 -0.433,0; 2 0.433,0
B3U-1000P = smd 0.8 x 1.7: 1 -1.7,0; 2 1.7,0
PTS645 = smd 1.55 x 1.3: 1 -3.975,2.25; 2 3.975,2.25; 3 3.975,-2.25; 4 -3.975,-2.25
TE_SSA12/SPDT = drill 1.092 pad 1.93: 1 -2.489,0; 2 2.489,0; IN 0,0
TESTPOINT_0.040IN = drill 1.016: TESTPOINT 0,0
TESTPOINT_0.078IN = drill 2.083: 1 0,0
LFCSP-16 = smd 0.7 x 0.35: 1 -1.85,0.975; 2 -1.85,0.325; 3 -1.85,-0.325; 4 -1.85,-0.975; 9 1.85,-0.975; 10 1.85,-0.325; 11 1.85,0.325; 12 1.85,0.975 | smd 0.35 x 0.7: 5 -0.975,-1.85; 6 -0.325,-1.85; 7 0.325,-1.85; 8 0.975,-1.85; 13 0.975,1.85; 14 0.325,1.85; 15 -0.325,1.85; 16 -0.975,1.85 | smd 1.95 x 1.95: PAD 0,0
UDFN-6-EXPOSED = smd 0.48 x 0.36: 1 -0.925,0.65; 2 -0.925,0; 3 -0.925,-0.65; 4 0.925,-0.65; 5 0.925,0; 6 0.925,0.65 | smd 0.71 x 1.4: EP 0,0
QFN-24/3MM = smd 0.6 x 0.23: 1 -1.5,1; 2 -1.5,0.6; 3 -1.5,0.2; 4 -1.5,-0.2; 5 -1.5,-0.6; 6 -1.5,-1; 13 1.5,-1; 14 1.5,-0.6; 15 1.5,-0.2; 16 1.5,0.2; 17 1.5,0.6; 18 1.5,1 | smd 0.23 x 0.6: 7 -1,-1.5; 8 -0.6,-1.5; 9 -0.2,-1.5; 10 0.2,-1.5; 11 0.6,-1.5; 12 1,-1.5; 19 1,1.5; 20 0.6,1.5; 21 0.2,1.5; 22 -0.2,1.5; 23 -0.6,1.5; 24 -1,1.5
4-SMD = smd 1 x 1: 1 -1,1; 2 -1,-1; 3 1,-1; 4 1,1
DFN-6/3MM = smd 0.85 x 0.45: 1 -1.45,1; 2 -1.45,0; 3 -1.45,-1; 4 1.45,-1; 5 1.45,0; 6 1.45,1 | smd 1.6 x 2.5: P$1 0,0
TSOT23-6 = smd 0.6 x 0.927: 1 -0.95,-1.126; 2 0,-1.126; 3 0.95,-1.126; 4 0.95,1.126; 5 0,1.126; 6 -0.95,1.126

### Placement (x,y rotation side)
A1  49.53,123.19 270 top
C1  31.75,85.72 180 top
C2  27.3,81.91 180 top
C3  54.23,113.03 180 top
C4  59.69,121.28 0 top
C5  31.11,69.85 180 top
C6  28.57,62.87 90 top
C7  27.94,65.41 90 top
C8  27.94,67.94 90 top
C9  27.3,83.82 180 top
C10  59.94,111.12 0 top
C11  23.11,109.35 0 top
D1  15.24,87.63 0 top
D2  3.81,50.16 0 top
D3  6.35,50.16 0 top
D4  8.89,50.16 0 top
D5  3.3,121.03 90 top
J1  48.39,7.11 180 top
J2  16.51,109.22 270 top
J3  15.24,16.51 90 top
J4  5.08,16.51 90 top
J5  45.72,16.51 90 top
J6  55.88,16.51 90 top
J7  25.4,16.51 90 top
J8  35.56,16.51 90 top
J9  7.62,97.79 0 top
R1  3.81,46.99 90 top
R2  6.35,46.99 90 top
R3  8.89,46.99 90 top
R4  23.5,119.38 270 top
R5  57.15,111.76 90 top
R6  27.3,80.01 180 top
R7  20.32,107.95 90 top
R8  29.84,106.04 180 top
R9  22.23,113.03 0 top
R10  23.5,123.82 90 top
R11  56.52,109.85 0 top
R12  53.98,109.85 180 top
R13  14.61,36.83 0 top
R14  14.61,33.66 0 top
R15  22.23,114.93 0 top
R16  29.84,102.23 0 top
S1  6.35,55.25 180 top
S2  8.26,120.65 0 top
S3  7.62,40.01 0 top
S4  7.62,29.21 0 top
S5  21.59,36.83 0 top
S6  21.59,27.94 0 top
TP1  61.59,62.23 0 top
TP2  61.59,64.77 0 top
TP3  61.59,67.31 0 top
TP4  61.59,69.85 0 top
TP5  61.59,72.39 0 top
TP6  61.59,74.93 0 top
TP7  61.59,77.47 0 top
TP8  61.59,84.07 0 top
TP9  61.59,101.85 0 top
TP10  1.91,74.93 0 top
TP11  1.91,69.85 0 top
TP12  1.91,67.31 0 top
TP13  1.91,64.77 0 top
TP14  1.91,62.23 0 top
TP15  61.59,27.94 0 top
TP16  61.59,40.64 0 top
TP17  61.59,30.48 0 top
TP18  61.59,38.1 0 top
TP19  61.59,33.02 0 top
TP20  61.59,35.56 0 top
TP21  61.59,43.18 0 top
TP22  61.59,80.01 0 top
TP23  61.59,106.93 0 top
TP24  61.59,104.39 0 top
TP25  61.59,25.4 0 top
TP26  61.59,22.86 0 top
TP27  1.91,72.39 0 top
TP28  61.59,86.61 0 top
TP29  61.59,89.15 0 top
TP30  61.59,91.69 0 top
TP31  61.59,94.23 0 top
TP32  61.59,96.77 0 top
TP33  1.91,97.79 0 top
TP34  1.91,95.25 0 top
TP35  1.91,90.17 0 top
TP36  1.91,87.63 0 top
TP37  1.91,85.09 0 top
TP38  1.91,82.55 0 top
TP39  61.59,99.31 0 top
TP40  61.59,6.35 0 top
TP41  1.91,6.35 0 top
TP42  1.91,59.05 0 top
TP43  60.33,55.88 0 top
TP44  3.17,79.38 0 top
U1  31.75,66.04 0 top
U2  59.69,113.66 90 top
U3  31.75,82.55 270 top
U4  59.69,118.74 0 top
U5  53.98,115.57 0 top
U6  26.04,102.23 180 top
U$4  [UCB_CAL_100MIL]  27.3,35.56 0 top

### Tracks (layer width: path | path; a pad name or v marks a point on that pad's centre or on a via)
!BUTTON_0  (via drill 0.2)
  Top 0.203: TP29.TESTPOINT J9.P1.12 54.23,90.8 47.95,90.8 47.95,90.81 47.11,90.81 43.81,87.51 v43.81,60.33 | S3.1 S3.2 | S3.2 14.17,39.68 R13.1 | S3.2 12.24,42.9 12.24,47.8 17.14,52.7 v20.32,52.7 | v36.83,60.33 36.65,60.15 36.64,60.15 29.67,53.17 29.67,53.15 29.4,52.88 29.39,52.88 v29.21,52.7
  Bottom 0.203: v20.32,52.7 v29.21,52.7 | v36.83,60.33 v43.81,60.33
!BUTTON_1  (via drill 0.2)
  Top 0.203: TP30.TESTPOINT J9.P1.13 48.33,91.69 47.95,91.31 46.86,91.31 43.18,87.63 v43.18,59.69 | S4.1 S4.2 11.88,31.75 v13.34,31.75 13.34,32.82 R14.1 | v15.88,31.75 16.51,32.38 16.51,43.18 18.41,45.09 18.41,50.8 19.68,52.07 v20.32,52.07 | v36.83,59.69 36.65,59.51 36.64,59.51 29.67,52.54 29.67,52.52 29.4,52.25 29.39,52.25 v29.21,52.07
  Bottom 0.203: v13.34,31.75 v15.88,31.75 | v20.32,52.07 v29.21,52.07 | v36.83,59.69 v43.18,59.69
!IMU_INTERRUPT  (via drill 0.2)
  Top 0.152: R6.1 29.28,81.55 U3.12
  Top 0.203: TP1.TESTPOINT J9.P1.01 | v41.27,71.75 v38.1,74.93 | v33.02,74.93 27.94,80.01 R6.1
  Bottom 0.203: v41.27,71.75 46.35,71.75 J9.P1.01 | v38.1,74.93 v33.02,74.93
!LCD_CS  (via drill 0.2)
  Top 0.203: TP3.TESTPOINT J9.P1.03 53.98,65.41 v53.98,60.33 | A1.16 47.62,76.99 v47.62,69.22
  Bottom 0.203: v47.62,69.22 53.98,62.87 v53.98,60.33
!LED_0  (via drill 0.2)
  Top 0.152: D2.C 6.87,53.98 13.34,53.98 14.61,55.25 v20.32,55.25
  Top 0.203: TP6.TESTPOINT J9.P1.06 | v46.35,62.87 v46.35,72.39 | v36.83,62.87 36.65,62.69 36.64,62.69 36.37,62.42 36.37,62.41 v29.21,55.25
  Bottom 0.203: v20.32,55.25 v29.21,55.25 | v36.83,62.87 v46.35,62.87 | v46.35,72.39 53.34,72.39 J9.P1.06
!LED_1  (via drill 0.2)
  Top 0.152: D3.C 9.11,53.67 13.46,53.67 14.4,54.61 v20.32,54.61
  Top 0.203: TP7.TESTPOINT J9.P1.07 | v45.72,62.23 v45.72,73.02 | v36.83,62.23 36.65,62.05 36.64,62.05 29.67,55.08 29.67,55.06 29.4,54.79 29.39,54.79 v29.21,54.61
  Bottom 0.203: v20.32,54.61 v29.21,54.61 | v36.83,62.23 v45.72,62.23 | J9.P1.07 51.44,73.02 v45.72,73.02
!LED_2  (via drill 0.2)
  Top 0.152: D4.C 11.31,53.34 v20.32,53.34
  Top 0.203: TP8.TESTPOINT J9.P1.10 51.69,88.27 47.95,88.27 47.11,88.27 45.09,86.24 v45.09,60.96 | v36.83,60.96 36.65,60.78 36.64,60.78 29.67,53.81 29.67,53.79 29.4,53.52 29.39,53.52 v29.21,53.34
  Bottom 0.203: v20.32,53.34 v29.21,53.34 | v36.83,60.96 v45.09,60.96
!LIGHT_INTERRUPT  (via drill 0.2)
  Top 0.203: TP2.TESTPOINT J9.P1.02 | U2.4 61.59,113.33 61.59,111.12 60.96,110.49 | R5.1 57.99,110.49 60.96,110.49 | v59.69,109.22 60.96,110.49
  Bottom 0.203: TP2.TESTPOINT 59.69,66.67 v59.69,109.22
!SD_CS  (via drill 0.2)
  Top 0.203: TP4.TESTPOINT J9.P1.04 53.34,72.39 53.34,83.18 v49.53,86.99 | v39.37,99.06 38.73,99.06 32.38,105.41 | v17.78,107.06 17.72,107.12 J2.2 | 32.38,105.41 30.48,107.31 v25.4,107.31 | R8.1 31.75,106.04 32.38,105.41
  Bottom 0.203: v49.53,86.99 48.26,88.27 47.11,88.27 45.72,88.27 43.18,90.8 43.18,97.79 41.91,99.06 v39.37,99.06 | v25.4,107.31 23.5,107.31 22.23,106.04 18.8,106.04 18.41,106.43 v17.78,107.06
!SD_DETECT  (via drill 0.2)
  Top 0.203: TP5.TESTPOINT J9.P1.05 55.24,72.39 53.98,73.66 53.98,83.82 v50.16,87.63 | J2.A 7.76,117.47 19.25,117.47 R15.1 22.14,114.59 22.14,114.56 22.39,114.3 26.04,114.3 39.37,100.96 v39.37,99.69
  Bottom 0.203: 46.96,88.62 | 46.96,88.62 46.35,88.62 43.81,91.16 43.81,98.17 42.29,99.69 v39.37,99.69 | v50.16,87.63 49.17,88.62 46.96,88.62 | 46.96,88.62
+3V3  (via drill 0.2)
  Top 0.203: J9.3.3V@2 TP33.TESTPOINT | TP34.TESTPOINT J9.3.3V@1 | TP35.TESTPOINT J9.3.3V@0 | U4.1 58.69,120.65 | 58.69,120.65 58.69,120.72 | U5.5 55.88,115.57 56.52,114.93 56.52,114.3 55.24,113.03 C3.1 | 58.69,120.72 C4.1 57.99,122.55 v57.78,122.55 | 58.69,120.72 58.69,120.65
  Bottom 0.203: S5.2 24.11,36.85 | 24.11,36.85 25.35,38.1 v33.66,38.1 | S6.2 S5.2 | S5.2 24.11,36.85
  pour Top: -4.45,125.09 1.27,130.81 68.58,130.81 74.93,124.46 74.93,1.9 70.48,-2.54 -4.45,-2.54 -6.99,0 -6.99,1.27 -6.99,122.55
+5V
  Top 0.203: TP36.TESTPOINT J9.5V
  Top 0.406: J9.5V D1.P$1
ANALOG_ACCEL_X  (via drill 0.2)
  Top 0.203: J9.P0.29 TP12.TESTPOINT | v17.78,67.31 27.74,67.31 C8.1 28.02,67.44 29.54,67.44 29.55,67.44 30.25,67.44 30.43,67.27 32.83,67.27 33.08,67.02 U1.12
  Bottom 0.203: J9.P0.29 v17.78,67.31
ANALOG_ACCEL_Y  (via drill 0.2)
  Top 0.203: J9.P0.30 TP13.TESTPOINT | v20.32,64.77 27.74,64.77 C7.1 28.78,64.13 29.94,64.13 30.6,64.79 32.81,64.79 32.98,64.96 32.98,65.23 33.25,65.49 33.38,65.49 U1.10
  Bottom 0.203: J9.P0.30 v20.32,64.77
ANALOG_ACCEL_Z  (via drill 0.2)
  Top 0.203: TP14.TESTPOINT J9.P0.31 | U1.8 32.73,63.2 31.95,62.43 C6.1 28.37,62.23 v22.86,62.23
  Bottom 0.203: J9.P0.31 v22.86,62.23
EXTERN_RX  (via drill 0.2)
  Top 0.203: J1.1 47.18,8.32 41.66,13.84 41.66,22.23 | J9.P0.25 36.91,30.4 38.59,30.4 39.29,29.7 39.29,28.78 41.66,26.42 41.66,22.23 | v41.4,10.92 9.67,10.92 J4.2 | TP25.TESTPOINT 58.42,22.23 41.66,22.23
  Bottom 0.203: J1.1 44.58,10.92 v41.4,10.92
EXTERN_TX
  Top 0.203: J9.P0.24 41.3,26.01 41.3,13.7 44.01,10.99 44.9,10.1 | 44.9,10.1 45.63,9.37 J1.2 47.02,5.71 50.16,5.71 53.98,9.52 57.78,9.52 61.59,13.34 TP26.TESTPOINT | 44.9,10.1 8.49,10.1 J4.1
GND  (via drill 0.2)
  Top 0.152: U3.11 30.21,81.91 28.6,81.91 28.1,81.41 27.38,81.41 C2.2
  Top 0.203: TP37.TESTPOINT J9.GND@0 | TP38.TESTPOINT J9.GND@1 | TP39.TESTPOINT J9.GND@2 | S3.3 S3.4 3.65,36.99 v4.45,36.2 | S4.3 S4.4 3.65,26.2 v4.45,25.4 | S2.3 S2.4 3.46,118.4 v1.91,116.84 1.91,115.77 J2.MOUNT2 | J2.MOUNT1 12.06,115.66 v12.06,116.84 | J2.MOUNT3 2.46,100.96 v2.54,100.96 | J2.MOUNT0 16.41,103.6 v17.14,102.87 | v60.96,111.76 60.96,111.71 C10.2 60.34,111.16 U2.3 U2.2 U2.EP | U5.2 51.44,115.57 51.44,114.3 52.7,113.03 C3.2 53.8,112.57 v54.23,112.14 | U4.4 60.69,120.72 C4.2 60.96,122.12 v60.96,122.3 | U1.3 29.78,65.84 C7.2 27.74,66.04 v26.67,66.04 | U1.7 32.08,63.57 31.8,63.3 31.11,63.3 | 30.35,63.3 C6.2 27.51,63.3 v27.3,63.5 | 30.35,63.3 31.11,63.3 | U1.6 31.43,63.61 31.11,63.3 | U1.5 30.77,63.72 30.35,63.3 | C8.2 28.78,69.22 v29.21,69.22 29.84,69.85 C5.2 | C2.2 26.77,82.02 | 26.77,82.02 26.04,82.75 v26.04,82.8 26.04,82.98 C9.2 | U3.9 27.5,82.75 26.77,82.02 | C1.2 31.11,85.72 v30.48,86.36 | U3.18 33.16,80.64 v33.66,80.64 34.04,81.03 34.04,81.47 33.56,81.95 U3.20 | J2.B 14.97,114.67 13.97,113.66 v13.97,113.03 13.97,112.39 14.85,111.52 J2.6 | C11.2 24.26,109.35 v24.77,109.85 | U6.4 24.94,100.96 v24.13,100.96 | v2.54,120.02 2.54,121.02 D5.C
  pour Bottom: -5.08,128.27 63.5,128.27 67.31,124.46 67.31,3.81 62.23,-1.27 0,-1.27 -7.62,6.35 -7.62,125.73
GROVE_A0  (via drill 0.2)
  Top 0.203: TP9.TESTPOINT J9.P0.02 50.16,96.14 46.74,96.14 45.78,95.19 36.83,86.23 36.83,64.13 37.47,63.5 37.47,40.01 38.91,38.56 38.92,38.56 41.91,35.57 41.91,28.79 42.69,28.02 44.37,28.02 v48.26,24.13 | J5.1 51.44,19.23 v51.44,20.95
  Bottom 0.203: v51.44,20.95 v48.26,24.13
GROVE_A1  (via drill 0.2)
  Top 0.203: TP10.TESTPOINT J9.P0.03 26.67,55.88 26.67,17.14 31.75,12.06 40.01,12.06 v40.64,12.7
  Bottom 0.203: J5.2 43.45,15.51 v40.64,12.7
GROVE_A2  (via drill 0.2)
  Top 0.203: TP11.TESTPOINT J9.P0.28 22.86,54.61 22.86,43.82 17.14,38.1 17.14,19.05 24.77,11.43 41.02,11.43 v41.66,12.06 | v46.35,10.79 53.16,10.79 J6.1
  Bottom 0.203: v41.66,12.06 45.09,12.06 v46.35,10.79
GROVE_D0
  Top 0.203: TP27.TESTPOINT J9.P0.04 23.5,56.52 23.5,43.18 17.78,37.46 17.78,21.13 20.41,18.5 | J7.1 20.41,18.5 | 20.41,18.5 20.32,18.59 20.41,18.5
GROVE_D1  (via drill 0.2)
  Top 0.203: TP22.TESTPOINT J9.P1.08 | v28.57,19.05 31.11,21.59 31.11,51.44 v36.83,57.15 | v48.9,74.93 48.9,62.87 43.18,57.15 v41.91,57.15
  Bottom 0.203: J7.2 28.57,18.69 v28.57,19.05 | v36.83,57.15 v41.91,57.15 | v48.9,74.93 53.98,80.01 J9.P1.08
GROVE_D2  (via drill 0.2)
  Top 0.203: TP21.TESTPOINT 54.61,36.2 45.72,36.2 v43.81,38.1 | v38.73,38.1 33.02,32.38 J9.P1.09 34.29,30.48 34.29,27.94 34.92,27.3 38.1,27.3 40.64,24.77 40.64,18.59 J8.1
  Bottom 0.203: v43.81,38.1 v38.73,38.1
LCD_MISO  (via drill 0.2)
  Top 0.203: J9.P0.14 53.34,26.67 57.78,26.67 TP17.TESTPOINT | v49.53,39.37 51.44,41.27 51.44,80.8 A1.13
  Bottom 0.203: J9.P0.14 49.53,30.48 v49.53,39.37
LCD_MOSI  (via drill 0.2)
  Top 0.203: TP15.TESTPOINT 60.96,27.94 58.42,25.4 52.07,25.4 J9.P0.16 | v46.99,39.37 50.8,43.18 50.8,78.9 A1.14
  Bottom 0.203: J9.P0.16 46.99,30.48 v46.99,39.37
LCD_SCLK  (via drill 0.2)
  Top 0.203: J9.P0.12 57.78,29.21 TP19.TESTPOINT | A1.12 52.07,82.71 v52.07,39.37
  Bottom 0.203: J9.P0.12 52.07,30.48 v52.07,39.37
N$1  (via drill 0.2)
  Top 0.203: J9.P0.18 44.45,30.48 44.45,34.29 38.1,40.64 38.1,64.13 37.47,64.77 37.47,85.72 v40.64,88.9 | S2.1 S2.2 12.72,123.39 R10.1 24.56,123.39 40.64,107.31 v40.64,98.42
  Bottom 0.203: v40.64,88.9 v40.64,98.42
N$2  (via drill 0.2)
  Top 0.406: v30.48,15.88 27.13,19.23 27.13,56.07 16.93,66.27 16.93,87.04 D1.P$2
  Bottom 0.305: 27.81,9.4 27.69,9.52
  Bottom 0.406: J1.8 29.07,8.14 27.81,9.4 | J1.9 26.31,8.14 27.69,9.52 27.69,13.08 v30.48,15.88
N$3
  Top 0.203: D5.A 4.94,121.03 6.59,119.38 13.97,119.38 14.61,118.74 23.29,118.74 R4.2
N$4
  Top 0.203: R3.2 D4.A
N$5
  Top 0.203: D3.A R2.2
N$7  (via drill 0.2)
  Top 0.203: U1.2 28.89,66.36 v28.57,66.67 | v28.57,60.96 v24.77,60.96 | v14.61,60.96 8.89,55.25 S1.1
  Bottom 0.203: v28.57,66.67 v28.57,60.96 | v24.77,60.96 v14.61,60.96
N$18  (via drill 0.2)
  Top 0.203: R7.2 19.07,108.38 18.13,109.32
  Top 0.406: U6.2 26.04,105.41 | U6.1 26.98,104.46 26.04,105.41 | J2.4 18.13,109.32 v18.16,109.35 | 26.04,105.41 25.27,105.41 v22.73,107.95 22.73,109.29 C11.1 22.68,113.01 | 22.68,113.01 R9.2 | R15.2 v23.5,114.93 | v23.5,113.66 22.84,113.01 22.68,113.01 | 26.04,105.41 28.78,105.41 R8.2
  Bottom 0.406: v18.16,109.35 21.59,109.35 22.73,108.2 v22.73,107.95 | v23.5,114.93 v23.5,113.66
N$19
  Top 0.152: C2.1 28.17,82.35 U3.10
N$25
  Top 0.203: R1.2 D2.A
N$50
  cutout Top: 56.52,113.66 50.8,113.66 50.8,119.38 55.88,119.38 57.15,119.38 57.15,121.92 61.59,121.92 61.59,115.57 56.52,115.57
N$51
  cutout Bottom: 56.52,113.66 50.8,113.66 50.8,119.38 57.15,119.38 57.15,121.92 61.59,121.92 61.59,115.57 56.52,115.57
SD_ENABLE  (via drill 0.2)
  Top 0.203: TP28.TESTPOINT J9.P1.11 52.96,89.53 v49.53,89.53 | v36.2,100.33 31.11,100.33 29.41,102.03 R16.1 25.4,102.23 25.09,102.55 U6.3
  Bottom 0.203: v49.53,89.53 48.01,91.06 45.72,91.06 44.45,92.33 44.45,98.29 42.41,100.33 v36.2,100.33
SD_MISO  (via drill 0.2)
  Top 0.203: J9.P0.13 52.7,33.66 57.15,33.66 TP18.TESTPOINT | v50.8,36.83 50.16,37.46 45.72,37.46 40.01,43.18 40.01,70.5 38.1,72.4 v38.1,73.02 | 20.32,111.25 18.92,112.65 16.44,112.65 J2.7 | v33.02,73.02 25.4,73.02 20.32,78.1 20.32,106.11 21.2,107 21.2,108.9 20.32,109.79 20.32,111.25 | 20.32,111.25 20.32,111.56 R9.1
  Bottom 0.203: v38.1,73.02 v33.02,73.02 | v50.8,36.83 J9.P0.13
SD_MOSI  (via drill 0.2)
  Top 0.203: TP16.TESTPOINT 55.88,34.92 51.44,34.92 J9.P0.15 39.37,40.64 39.37,70.48 v38.1,71.75 | v33.02,71.75 24.13,71.75 19.05,76.83 19.05,107.19 | J2.3 18.02,108.22 19.05,107.19 | 19.05,107.19 19.38,107.52 R7.1
  Bottom 0.203: v38.1,71.75 v33.02,71.75
SD_SCLK  (via drill 0.2)
  Top 0.203: J9.P0.11 57.78,31.75 TP20.TESTPOINT | v53.34,37.46 52.7,38.1 45.72,38.1 40.64,43.18 40.64,70.5 39.37,71.77 v39.37,72.39 | v33.02,72.39 24.77,72.39 19.68,77.47 19.68,105.98 20.85,107.14 20.85,108.76 19.18,110.42 J2.5
  Bottom 0.203: v39.37,72.39 v33.02,72.39 | v53.34,37.46 J9.P0.11
SENSORS_SCL  (via drill 0.2)
  Top 0.203: TP23.TESTPOINT J9.P0.27 56.08,107.14 R11.1 56.08,110.92 v55.88,111.12 | U4.3 60.69,116.2 | 60.69,116.2 60.69,115.93 59.69,114.93 U2.5 | 60.69,116.2 v59.94,116.2 | U5.6 55.79,116.2 v56.52,116.2 | U3.23 33.69,83.15 34.92,81.91 | v28.57,24.77 28.57,55.5 35.56,62.48 v35.56,78.1 | 34.92,81.91 | 34.92,81.91 v34.92,80.01 | v49.15,101.35 48.77,100.97 47.11,100.97 46.51,100.37 46.51,99.85 v34.29,87.63
  Bottom 0.203: v59.94,116.2 v56.52,116.2 55.88,115.57 v55.88,111.12 | J3.1 17.32,13.51 v28.57,24.77 | v35.56,78.1 35.56,78.74 34.92,79.38 v34.92,80.01 34.92,86.99 v34.29,87.63 | J9.P0.27 50.29,101.35 v49.15,101.35
SENSORS_SDA  (via drill 0.2)
  Top 0.203: J9.P0.26 TP24.TESTPOINT | U2.6 59.04,117.39 U4.2 53.7,117.74 U5.1 51.98,116.03 51.25,116.03 50.98,115.76 50.98,114.25 54.06,111.17 54.06,110.2 R12.1 54.41,105.87 J9.P0.26 | U3.24 33.92,83.55 | 33.92,83.55 35.56,81.91 35.56,79.38 34.92,78.74 34.92,62.87 27.94,55.88 v27.94,25.4 | J9.P0.26 50.16,98.68 46.99,98.68 46.61,98.68 33.92,85.99 33.92,83.55
  Bottom 0.203: J3.2 18.05,15.51 v27.94,25.4
SWITCH_0  (via drill 0.2)
  Top 0.203: TP31.TESTPOINT J9.P1.14 49.15,94.23 48.26,93.35 47.11,93.35 46.51,92.75 46.51,91.6 42.55,87.63 v42.55,59.05 | S5.IN 25.4,40.64 25.4,50.8 v26.04,51.44 | v36.83,59.05 36.65,58.88 36.64,58.88 29.67,51.9 29.67,51.88 29.4,51.61 29.39,51.61 v29.21,51.44
  Bottom 0.203: v26.04,51.44 v29.21,51.44 | v36.83,59.05 v42.55,59.05
SWITCH_1  (via drill 0.2)
  Top 0.203: TP32.TESTPOINT J9.P1.15 53.72,94.61 48.9,94.61 47.98,93.7 46.96,93.7 46.16,92.9 46.16,91.88 41.91,87.63 v41.91,58.42 | S6.IN 26.04,32.38 v26.04,50.79 | v36.83,58.42 29.67,51.26 29.67,51.25 29.4,50.98 29.39,50.98 v29.21,50.8
  Bottom 0.203: v26.04,50.79 v26.05,50.8 v29.21,50.8 | v36.83,58.42 v41.91,58.42

### Text on the board
tPlace: RESET | POWER | PRESSURE | TEMPERATURE / & HUMIDITY | LIGHT | SCL | SDA | GROVE_A0 | SD Card | SWITCH_1 | SWITCH_0 | !BUTTON_1 | I2C ACCELEROMETER / GYRO & MAGNETOMETER | !BUTTON_0 | SD_ENABLE | !LED_2 | GROVE_D1 | !LED_1 | GND | GROVE_A1 | !LED_0 | GROVE_D0 | !SD_DETECT | GROVE_A2 | !SD_CS | ACCEL_X | ANALOG / ACCELEROMETER | !LCD_CS | ACCEL_Y | !LIGHT_INT | ACCEL_Z | !IMU_INT | ACCEL / SELF TEST | GND | LED1 | GND | LED0 | LED2 | GROVE / D2 | Berkeley Buckler | A | Branden Ghena | August 2018 | SD / MOSI | SD / MISO | BTN_0 | SD / SCLK | SWITCH_0 | GROVE_D2 | EXTERN_RX | SD_MOSI | SD_MISO | SD_SCLK | LCD / SCLK | LCD / MISO | LCD / MOSI | EXTERN_TX | LCD_MOSI | LCD_MISO | LCD_SCLK | BTN_1 | RX | SWITCH_1 | EXTERN | TX | GND | GND | GND | GND | GND | GND | 3V3 | 3V3 | 3V3 | 3V3 | 3V3 | 3V3 | RX | SDA | D1 | NC | A1 | NC | TX | SCL | D0 | D2 | A0 | A2 | GND | GND